# Altium schematic sheet Hall_LDOs.SchDoc
size 420 x 297 mm; Address1: Address1; Address2: Address2; Address3: Address3; Address4: Address4; SheetNumber: 1; Scale: 1:1; Разраб.: Иванов; Обозначение документа: АБВГ.123456.001 Э3; Пров.: Петров; Утв.: Сидоров; Наименование организации: ОАО "Концерн "МПО-Гидроприбор"; Перв. применение: АБВГ.123456.000; Наименование изделия 1: Плата; Наименование изделия 2: Схема электрическая; Наименование изделия 3: принципиальная; Нач. отд.: Нач. отд.; Фамилия нач. отд.: Сидоров
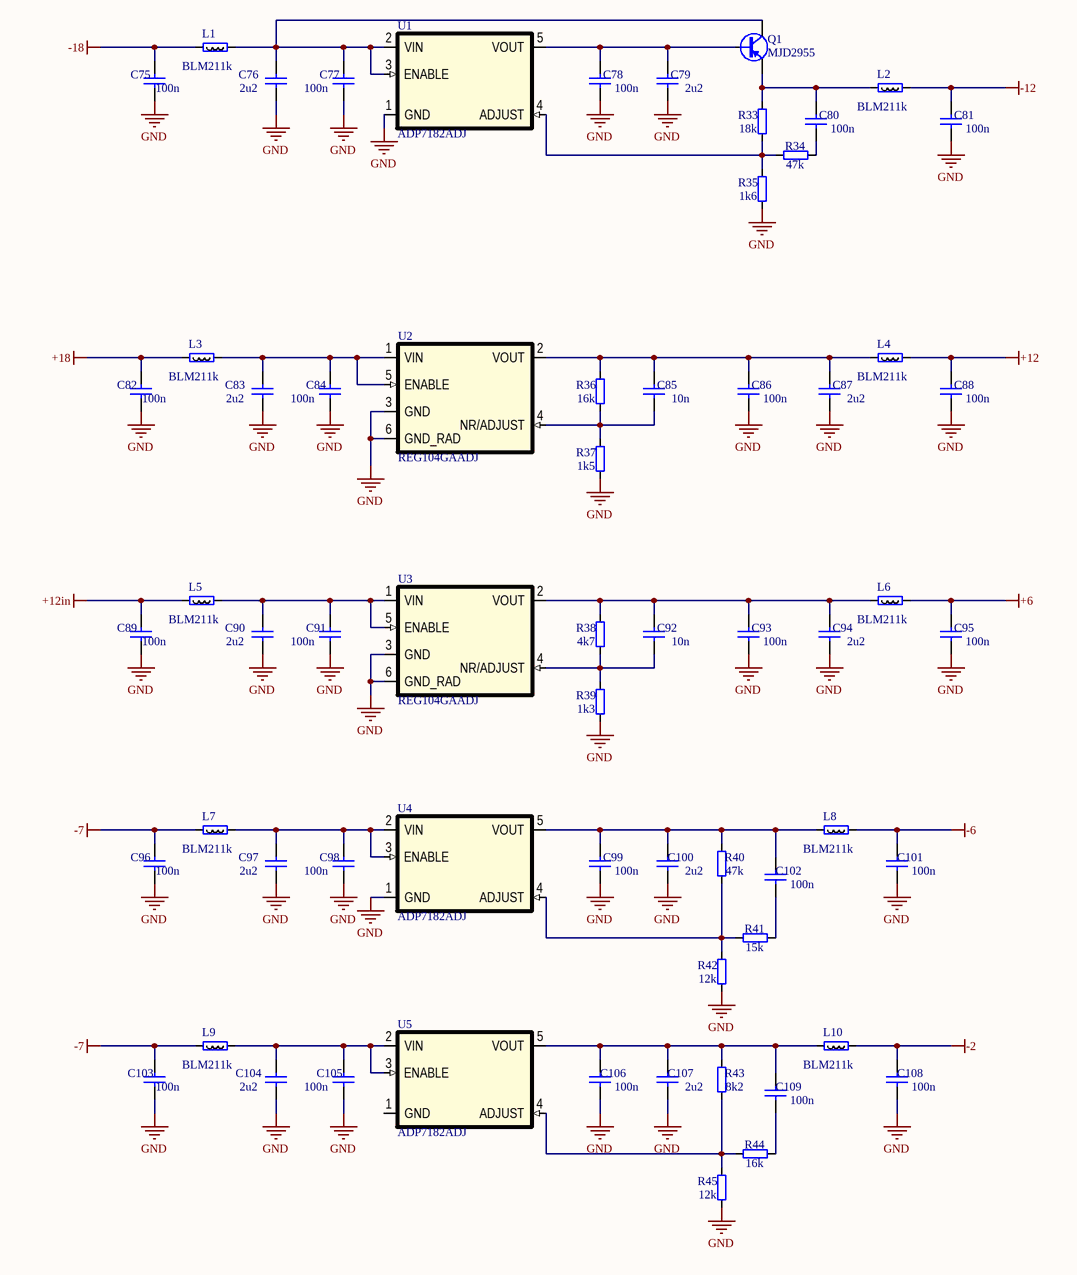
[diagram p0: Hall_LDOs.SchDoc]

## Parts
C75  100n  [0603]
C76  2u2  [0805]
C77  100n  [0603]
C78  100n  [0603]
C79  2u2  [0805]
C80  100n  [0603]
C81  100n  [0603]
C82  100n  [0603]
C83  2u2  [0805]
C84  100n  [0603]
C85  10n  [0603]
C86  100n  [0603]
C87  2u2  [0805]
C88  100n  [0603]
C89  100n  [0603]
C90  2u2  [0805]
C91  100n  [0603]
C92  10n  [0603]
C93  100n  [0603]
C94  2u2  [0805]
C95  100n  [0603]
C96  100n  [0603]
C97  2u2  [0805]
C98  100n  [0603]
C99  100n  [0603]
C100  2u2  [0805]
C101  100n  [0603]
C102  100n  [0603]
C103  100n  [0603]
C104  2u2  [0805]
C105  100n  [0603]
C106  100n  [0603]
C107  2u2  [0805]
C108  100n  [0603]
C109  100n  [0603]
L1  BLM211k  [0805]
L2  BLM211k  [0805]
L3  BLM211k  [0805]
L4  BLM211k  [0805]
L5  BLM211k  [0805]
L6  BLM211k  [0805]
L7  BLM211k  [0805]
L8  BLM211k  [0805]
L9  BLM211k  [0805]
L10  BLM211k  [0805]
Q1  MJD2955  [DPAK]
R33  18k  [0603]
R34  47k  [0603]
R35  1k6  [0603]
R36  16k  [0603]
R37  1k5  [0603]
R38  4k7  [0603]
R39  1k3  [0603]
R40  47k  [0603]
R41  15k  [0603]
R42  12k  [0603]
R43  8k2  [0603]
R44  16k  [0603]
R45  12k  [0603]
U1  ADP7182ADJ  [SOT23-5]
U2  REG104GAADJ  [SOT223_6-127]
U3  REG104GAADJ  [SOT223_6-127]
U4  ADP7182ADJ  [SOT23-5]
U5  ADP7182ADJ  [SOT23-5]

## Nets
+6: C95.2 L6.2
+12: C88.2 L4.2
+12in: C89.2 L5.1
+18: C82.2 L3.1
-2: C108.2 L10.2
-6: C101.2 L8.2
-7: C96.2 C103.2 L7.1 L9.1
-12: C81.2 L2.2
-18: C75.2 L1.1
GND: C75.1 C76.1 C77.1 C78.1 C79.1 C81.1 C82.1 C83.1 C84.1 C86.1 C87.1 C88.1 C89.1 C90.1 C91.1 C93.1 C94.1 C95.1 C96.1 C97.1 C98.1 C99.1 C100.1 C101.1 C103.1 C104.1 C105.1 C106.1 C107.1 C108.1 R35.1 R37.1 R39.1 R42.1 R45.1 U1.1(GND) U2.3(GND) U2.6(GND_RAD) U3.3(GND) U3.6(GND_RAD) U4.1(GND)
NetC76_2: C76.2 C77.2 L1.2 Q1.3(C) U1.2(VIN) U1.3(ENABLE)
NetC78_2: C78.2 C79.2 Q1.1(B) U1.5(VOUT)
NetC80_1: C80.1 R34.2
NetC80_2: C80.2 L2.1 Q1.2(E) R33.2
NetC83_2: C83.2 C84.2 L3.2 U2.1(VIN) U2.5(ENABLE)
NetC85_1: C85.1 R36.1 R37.2 U2.4(NR/ADJUST)
NetC85_2: C85.2 C86.2 C87.2 L4.1 R36.2 U2.2(VOUT)
NetC90_2: C90.2 C91.2 L5.2 U3.1(VIN) U3.5(ENABLE)
NetC92_1: C92.1 R38.1 R39.2 U3.4(NR/ADJUST)
NetC92_2: C92.2 C93.2 C94.2 L6.1 R38.2 U3.2(VOUT)
NetC97_2: C97.2 C98.2 L7.2 U4.2(VIN) U4.3(ENABLE)
NetC99_2: C99.2 C100.2 C102.2 L8.1 R40.2 U4.5(VOUT)
NetC102_1: C102.1 R41.2
NetC104_2: C104.2 C105.2 L9.2 U5.2(VIN) U5.3(ENABLE)
NetC106_2: C106.2 C107.2 C109.2 L10.1 R43.2 U5.5(VOUT)
NetC109_1: C109.1 R44.2
NetR33_1: R33.1 R34.1 R35.2 U1.4(ADJUST)
NetR40_1: R40.1 R41.1 R42.2 U4.4(ADJUST)
NetR43_1: R43.1 R44.1 R45.2 U5.4(ADJUST)

Not connected (* = marked no-connect by the designer): U5 1(GND)

## Notes on the sheet
- Подп. и дата
- Инв. № дубл.
- Взам. инв. №
- Инв. № подл.
- Изм.
- Лист
- № докум.
- Подп.
- Дата
- Копировал
- Формат А3

## Library data of the parts
C75-C109 = Capacitor
L1-L10 = BLM21: SMD Ferrite bead 0805; Vendor: Vishay; Value: 1k; Pkg: SMD0805; SMD Solders: 2; Solder Option: RM; Price: 10; Device: BLM21
Q1 = MJD2955: PNP транзистор; Vendor: ON Semiconductor; SMD Solders: 3; Solder Option: RM; Name to order: MJD29G55; Voltage: -60V; Pkg: DPAK; Price: 100; Device: MJD2955
R33-R45 = Resistor
U1 U4 U5 = ADP7182: Negative LDO Linear stabilizer; Vendor: Analog Devoces; Value: ADJ; SMD Solders: 5; Solder Option: RM; Name to order: ADP7182AUJZ-R7; Vref: 1V22; Pkg: SOT23-5; Price: 100; Device: ADP7182
U2 U3 = REG104GA: Positive LDO Linear stabilizer; Vendor: Texas Instruments; Value: ADJ; SMD Solders: 6; Solder Option: RM; TC: 70ppm/C; Tolerance: +-2% Max; Pkg: SOT223-6; Name to order: REG104GA-A; Vref: 1V295; Price: 1000; Device: REG104GA